# Altium schematic sheet 00 - SAMA7G54-Block Diagram.SchDoc
size B; CompanyName: Microchip Technology Inc.; Organization: Microchip Technology; Address1: 2355 West Chandler Blvd.; Address2: Chandler, AZ  85224; Address4: USA; SheetNumber: 1; SheetTotal: 15; SheetTitle: Block Diagram; Time: Time
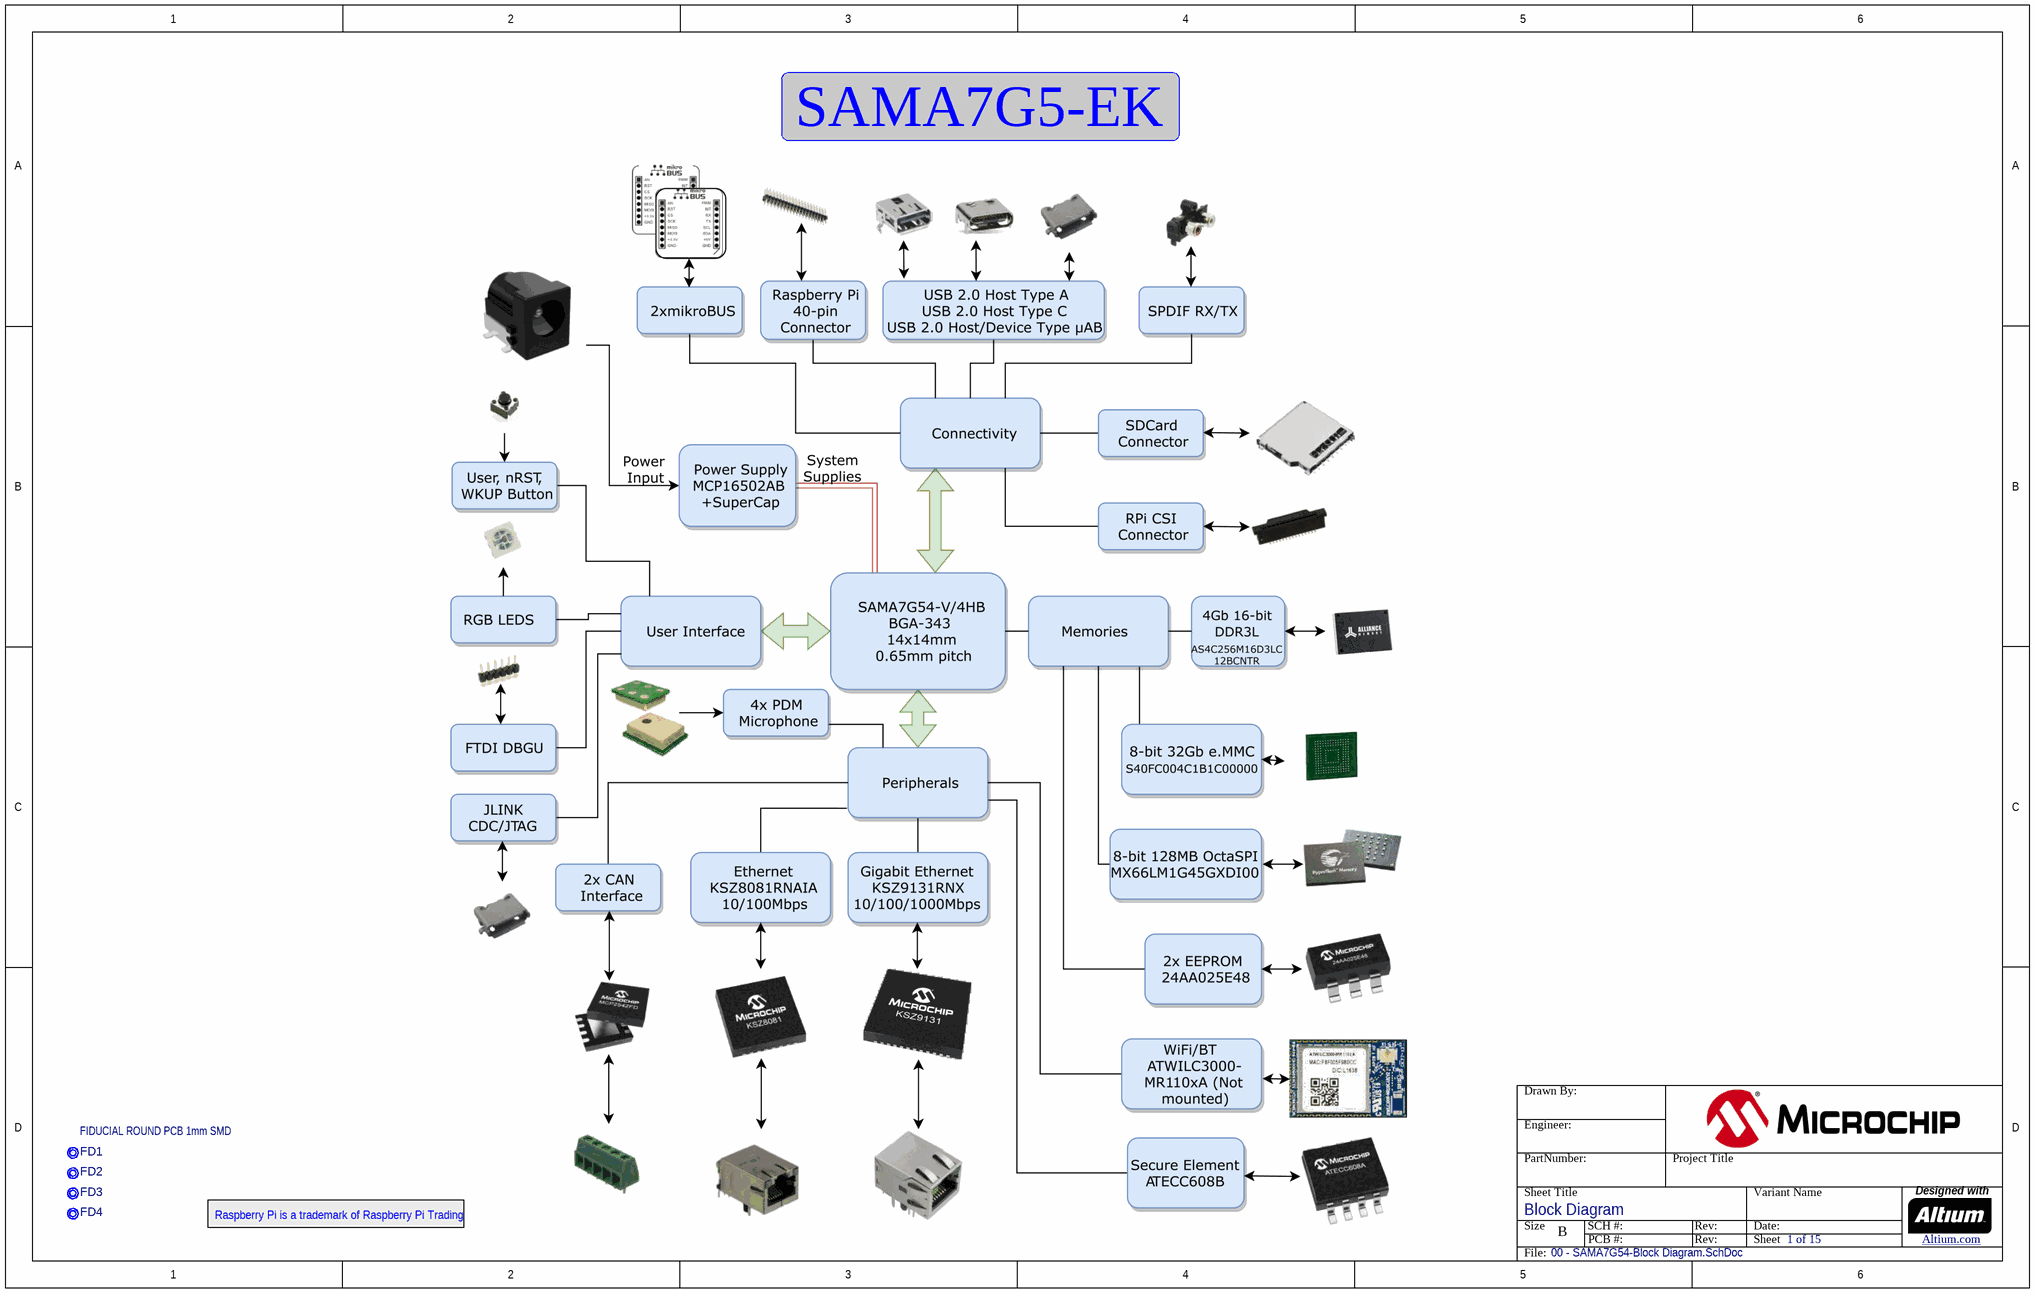
[diagram p0: 00 - SAMA7G54-Block Diagram.SchDoc]

## Parts
?  (no value)  (graphical)
FD1  Description_: FIDUCIAL ROUND PCB 1mm SMD  [Fiducial_1mm]  (hidden comment: FIDUCIAL ROUND)  (no BOM)
FD2  FIDUCIAL ROUND  [Fiducial_1mm]  (value not drawn)  (no BOM)
FD3  FIDUCIAL ROUND  [Fiducial_1mm]  (value not drawn)  (no BOM)
FD4  FIDUCIAL ROUND  [Fiducial_1mm]  (value not drawn)  (no BOM)

## Nets

Not connected (* = marked no-connect by the designer): FD1 1; FD2 1; FD3 1; FD4 1

## Notes on the sheet
- SAMA7G5-EK
- Raspberry Pi is a trademark of Raspberry Pi Trading
- Drawn By:
- Engineer:
- PartNumber:
- Project Title
- Sheet Title
- Size
- B
- SCH #:
- PCB #:
- Rev:
- Variant Name
- Date:
- Sheet
- Designed with
- Altium.com <http://go.altium.com/MicrochipLandingPage_Evaluation.html>
- File:

## Library data of the parts
? = Title Block B
FD1 = MECH0282: Fiducial; Dev Tools Status: Design; Owner: Dragos Danaila; Populated: MECH; MCHP-ID: MECH0282; Value: Fiducial; Revision: A; Symbol: FIDUCIAL ROUND; Status: MCL Design; ComponentLink1Description: SVN Datasheet; ComponentLink2Description: Local Datasheet; ComponentLink3URL: C:\ALTIUM_WORK\00001_MCHP-CDB\Library\LibraryRefs\FIDUCIAL ROUND.SchLib; ComponentLink3Description: Open Symbol; ComponentLink4URL: C:\ALTIUM_WORK\00001_MCHP-CDB\Library\Footprints\Fiducial_1mm.PcbLib; ComponentLink4Description: Open Footprint; ComponentLink5Description: Open Footprint 2; ComponentLink6Description: Open Footprint 3; ComponentLink7Description: Open Footprint 4; Type: Fiducial; Category: Hardware; Quantity Override: 1
FD2-FD4 = MECH0282: Fiducial; Description_: FIDUCIAL ROUND PCB 1mm SMD; Dev Tools Status: Design; Owner: Dragos Danaila; Populated: MECH; MCHP-ID: MECH0282; Value: Fiducial; Revision: A; Symbol: FIDUCIAL ROUND; Status: MCL Design; ComponentLink1Description: SVN Datasheet; ComponentLink2Description: Local Datasheet; ComponentLink3URL: C:\ALTIUM_WORK\00001_MCHP-CDB\Library\LibraryRefs\FIDUCIAL ROUND.SchLib; ComponentLink3Description: Open Symbol; ComponentLink4URL: C:\ALTIUM_WORK\00001_MCHP-CDB\Library\Footprints\Fiducial_1mm.PcbLib; ComponentLink4Description: Open Footprint; ComponentLink5Description: Open Footprint 2; ComponentLink6Description: Open Footprint 3; ComponentLink7Description: Open Footprint 4; Type: Fiducial; Category: Hardware; Quantity Override: 1